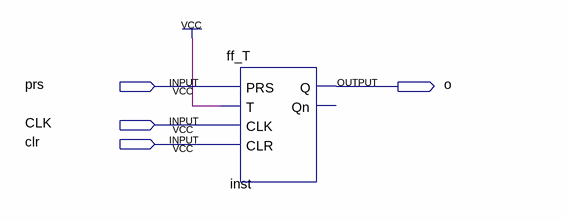
[diagram p0: schematic sheet]
// Quartus schematic test1.bdf as structural Verilog: 1 symbols, 4 pins
module test1 (
  input  prs,
  input  CLK,
  input  clr,
  output o
);

  ff_T inst (.PRS(prs), .T(1'b1), .CLK(CLK), .CLR(clr), .Q(o));  // open: Qn
endmodule
